# EAGLE design SD A6C GPRS Camera v1.0 (EAGLE 8.1.1)
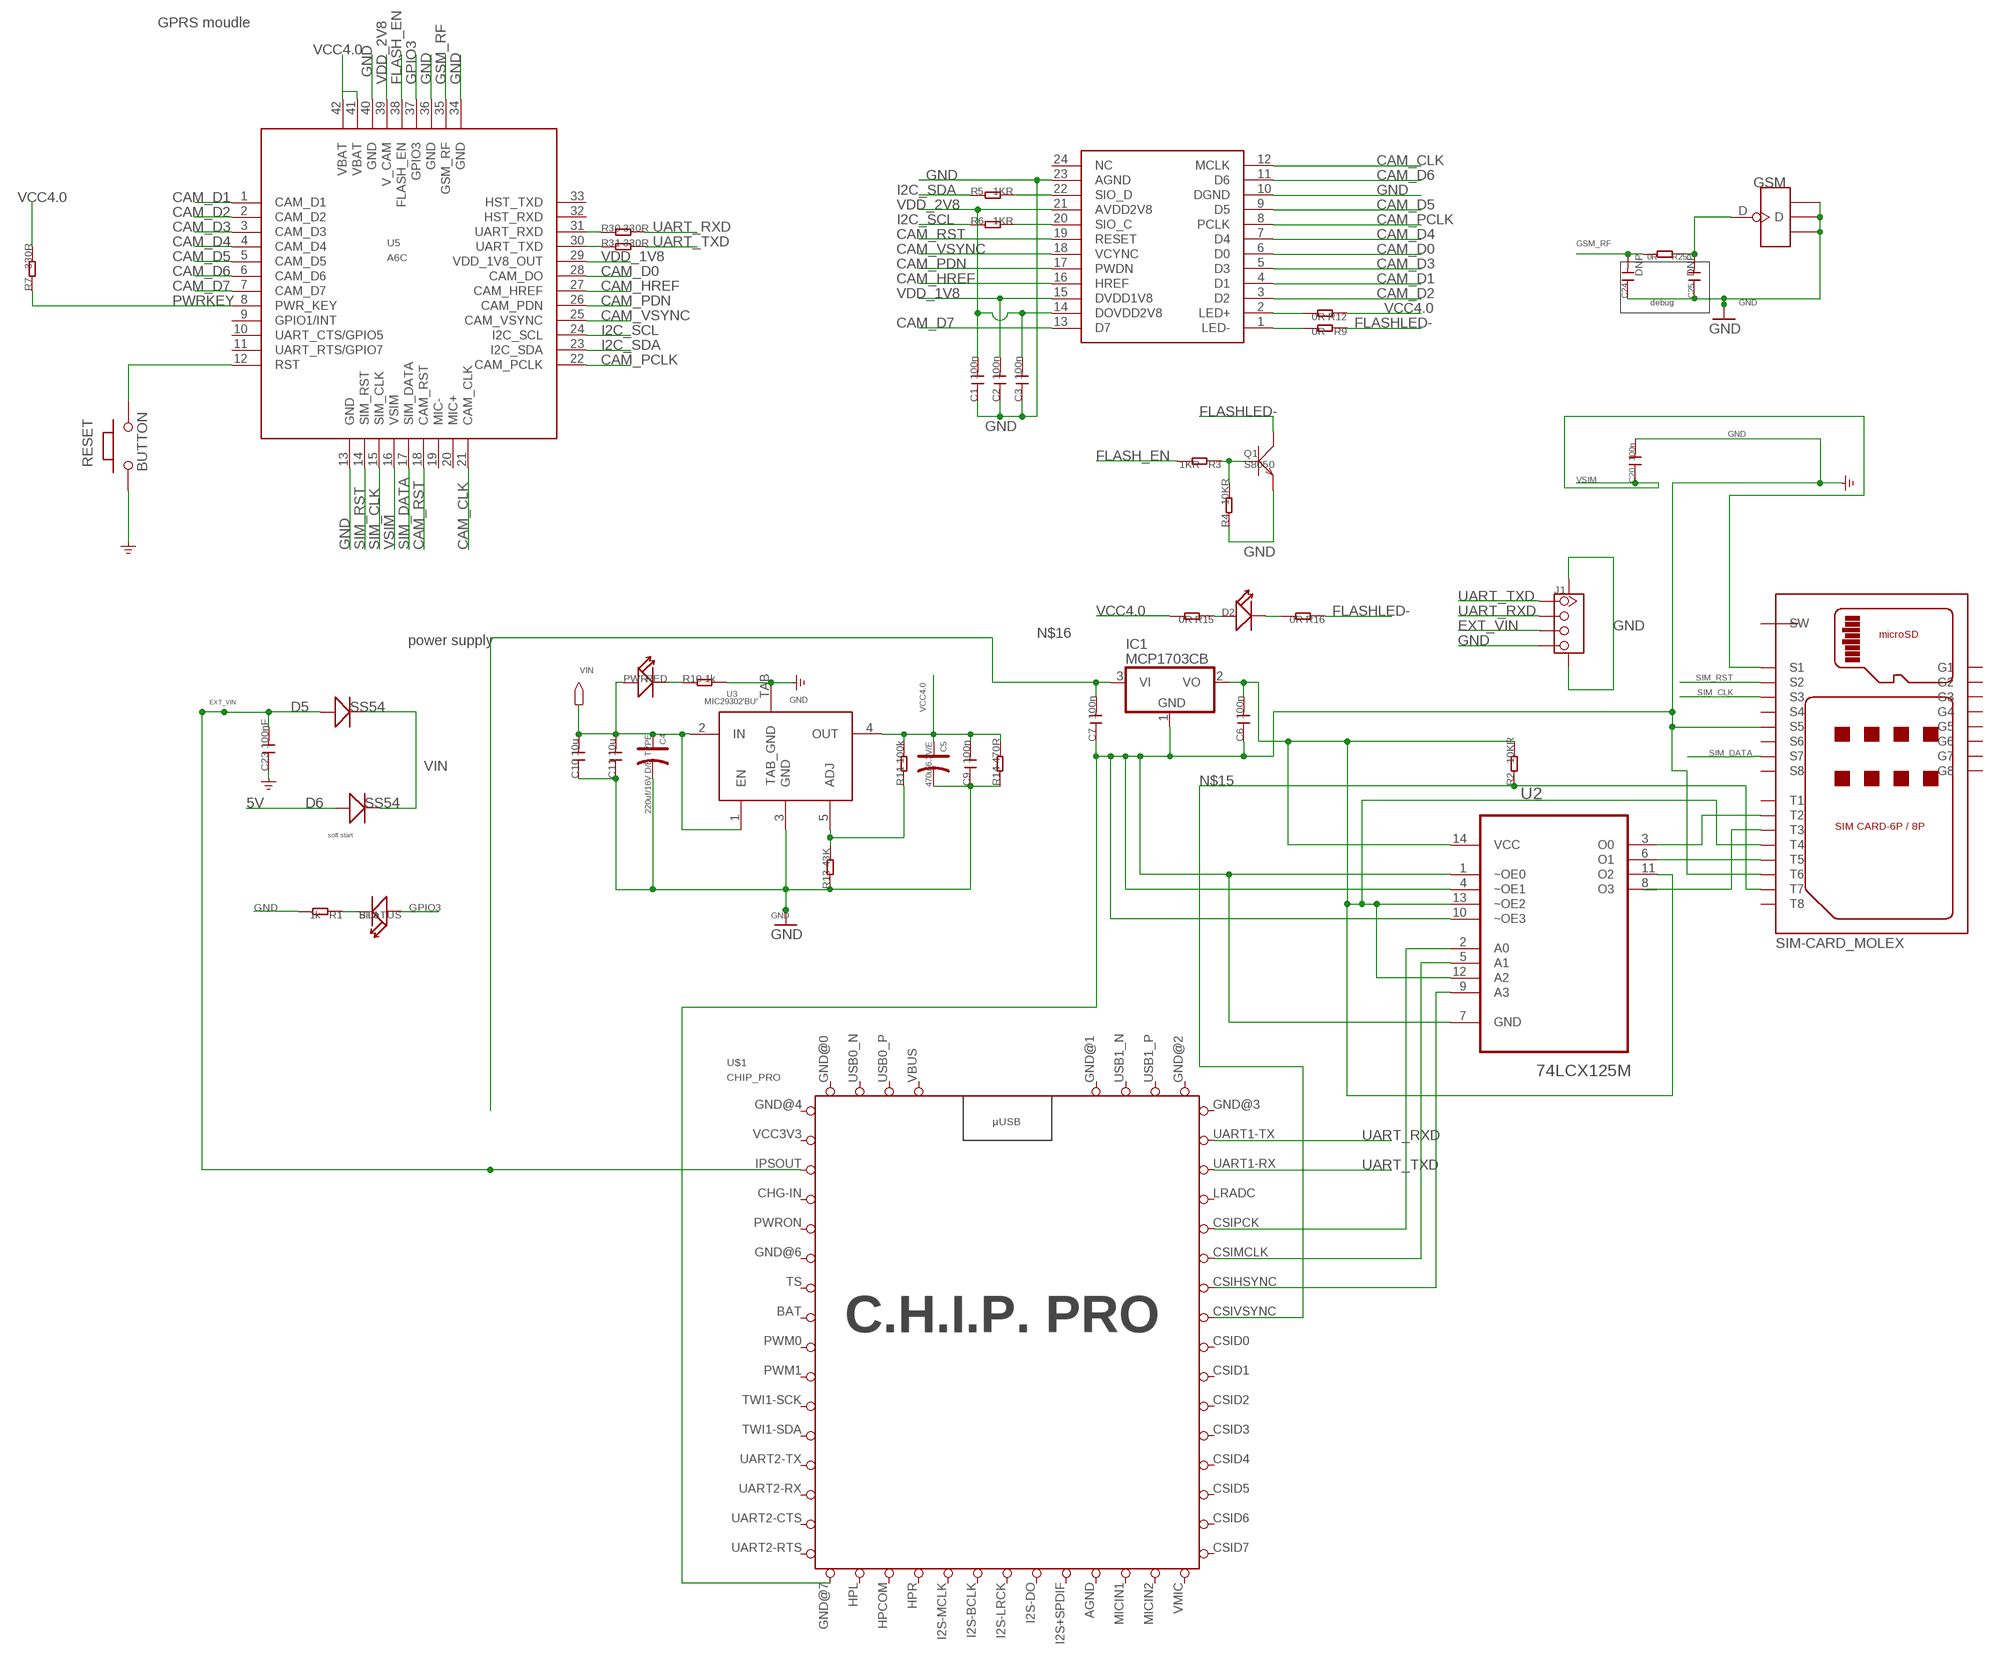
[diagram p0: schematic, sheet 1]

## Parts
C1  100n  C-0603  [C0603]
C2  100n  C-0603  [C0603]
C3  100n  C-0603  [C0603]
C4  220uf/16V D/E TYPE  006-CAP_AVX_D  [AVX_D]
C5  470u/6.3V/E  006-CAP_AVX_D  [AVX_D]
C6  100n  C-0603  [C0603]
C7  100n  C-0603  [C0603]
C9  100n  C-0603  [C0603]
C10  10u  C-0603  [C0603]
C11  10u  C-0603  [C0603]
C20  100n  C-0603  [C0603]
C23  100nF  C-0603  [C0603]
C24  DNP  C-0402  [C0402]
C25  DNP  C-0402  [C0402]
D2  LED'0805'  [LED-0805]
D5  SS54  D'MBRS240LT3'  [SMB]
D6  SS54  D'MBRS240LT3'  [SMB]
GSM  ANTENNA-U-FL  [4P-U-FL]
IC1  MCP1703CB  [SOT23]
J1  TWIG-4P-2.0-SMD-FEMALE-REINFORCE'90D'  [4P-SMD-2.0-90D]
PWR  RED  007-LED0603  [D0603]
Q1  S8050  TRANSISTOR-NPN-SOT23  [SOT23]
R1  1k  R-0603  [R0603]
R2  10KR  R-0603  [R0603]
R3  1KR  R-0603  [R0603]
R4  10KR  R-0603  [R0603]
R5  1KR  R-0603  [R0603]
R6  1KR  R-0603  [R0603]
R7  330R  R-0603  [R0603]
R9  0R  R-0603  [R0603]
R10  1k  R-0603  [R0603]
R11  100k  R-0603  [R0603]
R12  0R  R-0603  [R0603]
R13  43K  R-0603  [R0603]
R14  470R  R-0603  [R0603]
R15  0R  R-0603  [R0603]
R16  0R  R-0603  [R0603]
R25  0R  R-0402  [R0402]
R30  330R  R-0603  [R0603]
R31  330R  R-0603  [R0603]
RESET  BUTTON  PB157  [157SW]
STATUS  Blue  007-LED0603  [D0603]
U1  FPC-SOCKET-0.5-24P  [24P-0.5-90D]
U2  74LCX125M  [SOIC127P600X175-14N]
U3  MIC29302'BU'  [TO-263]
U5  A6C  [A6C]
U$1  CHIP_PRO  [CHIP_PRO]
U$4  SIM-CARD_MOLEX  [SIM-CARD_MOLEX]

## Nets
5V: D6.+
CAM_CLK: U1.12(MCLK) U5.21(CAM_CLK)
CAM_D0: U1.6(D0) U5.28(CAM_DO)
CAM_D1: U1.4(D1) U5.1(CAM_D1)
CAM_D2: U1.3(D2) U5.2(CAM_D2)
CAM_D3: U1.5(D3) U5.3(CAM_D3)
CAM_D4: U1.7(D4) U5.4(CAM_D4)
CAM_D5: U1.9(D5) U5.5(CAM_D5)
CAM_D6: U1.11(D6) U5.6(CAM_D6)
CAM_D7: U1.13(D7) U5.7(CAM_D7)
CAM_HREF: U1.16(HREF) U5.27(CAM_HREF)
CAM_PCLK: U1.8(PCLK) U5.22(CAM_PCLK)
CAM_PDN: U1.17(PWDN) U5.26(CAM_PDN)
CAM_RST: U1.19(RESET) U5.18(CAM_RST)
CAM_VSYNC: U1.18(VCYNC) U5.25(CAM_VSYNC)
EXT_VIN: C23.2 D5.+ J1.3 U$1.IPSOUT
FLASH_EN: R3.2 U5.38(FLASH_EN)
FLASHLED-: Q1.3(C) R9.1 R16.1
GND: C1.1 C2.1 C3.1 C4.- C5.- C6.1 C7.1 C9.1 C10.1 C11.1 C20.2 C23.1 C24.1 C25.1 GSM.GND1 GSM.GND2 GSM.GND3 IC1.1(GND) J1.4 J1.SS1 J1.SS2 Q1.2(E) R1.2 R4.1 R10.2 R13.1 R14.1 RESET.1 U1.10(DGND) U1.23(AGND) U2.1(~OE0) U2.4(~OE1) U2.7(GND) U2.10(~OE3) U3.3(GND) U3.TAB(TAB_GND) U5.13(GND) U5.34(GND) U5.36(GND) U5.40(GND) U$1.GND@7(GND) U$4.S5 U$4.T6
GPIO3: STATUS.+ U5.37(GPIO3)
GSM_RF: C24.2 R25.2 U5.35(GSM_RF)
I2C_SCL: R6.1 U5.24(I2C_SCL)
I2C_SDA: R5.1 U5.23(I2C_SDA)
N$1: R1.1 STATUS.-
N$2: R30.1 U5.31(UART_RXD)
N$3: Q1.1(B) R3.1 R4.2
N$4: R31.1 U5.30(UART_TXD)
N$5: R11.1 R13.2 U3.5(ADJ)
N$6: D2.+ R15.1
N$7: RESET.2 U5.12(RST)
N$8: R5.2 U1.22(SIO_D)
N$9: D2.- R16.2
N$10: R6.2 U1.20(SIO_C)
N$11: U2.6(O1) U$4.T5
N$12: U2.8(O3) U$4.T3
N$13: U2.3(O0) U$4.T2
N$14: C6.2 IC1.2(VO) R2.2 U2.11(O2) U2.12(A2) U2.13(~OE2) U2.14(VCC) U$4.T4
N$15: R2.1 U$1.CSIVSYNC U$4.T7
N$16: C7.2 IC1.3(VI)
N$17: U2.2(A0) U$1.CSIPCK
N$18: U2.5(A1) U$1.CSIMCLK
N$19: PWR.- R10.1
N$20: R9.2 U1.1(LED-)
N$21: R12.2 U1.2(LED+)
N$22: U2.9(A3) U$1.CSIHSYNC
N$25: C25.2 GSM.D R25.1
PWRKEY: R7.1 U5.8(PWR_KEY)
SIM_CLK: U5.15(SIM_CLK) U$4.S3
SIM_DATA: U5.17(SIM_DATA) U$4.S7
SIM_RST: U5.14(SIM_RST) U$4.S2
UART_RXD: J1.2 R30.2 U$1.UART1-TX
UART_TXD: J1.1 R31.2 U$1.UART1-RX
VCC4.0: C5.+ C9.2 R7.2 R11.2 R12.1 R14.2 R15.2 U3.4(OUT) U5.41(VBAT) U5.42(VBAT)
VDD_1V8: C2.2 U1.15(DVDD1V8) U5.29(VDD_1V8_OUT)
VDD_2V8: C1.2 C3.2 U1.14(DOVDD2V8) U1.21(AVDD2V8) U5.39(V_CAM)
VIN: C4.+ C10.2 C11.2 D5.- D6.- PWR.+ U3.1(EN) U3.2(IN)
VSIM: C20.1 U5.16(VSIM) U$4.S1
Unconnected: U1.24(NC) U5.9(GPIO1/INT) U5.10(UART_CTS/GPIO5) U5.11(UART_RTS/GPIO7) U5.19(MIC-) U5.20(MIC+) U5.32(HST_RXD) U5.33(HST_TXD) U$1.BAT U$1.CSID0 U$1.CSID1 U$1.CSID2 U$1.CSID3 U$1.CSID4 U$1.CSID5 U$1.CSID6 U$1.CSID7 U$1.HPCOM U$1.HPL U$1.HPR U$1.I2S+SPDIF(I2SSPDIF) U$1.I2S-BCLK(I2SBCLK) U$1.I2S-DO(I2SDO) U$1.I2S-LRCK(I2SLRCK) U$1.I2S-MCLK(I2SMCLK) U$1.LRADC U$1.MICIN1 U$1.MICIN2 U$1.PWM0 U$1.PWM1 U$1.PWRON U$1.TS U$1.TWI1-SCK U$1.TWI1-SDA U$1.UART2-CTS U$1.UART2-RTS U$1.UART2-RX U$1.UART2-TX U$1.USB0_N U$1.USB0_P U$1.USB1_N U$1.USB1_P U$1.VMIC U$4.G1 U$4.G2 U$4.G3 U$4.G4 U$4.G5 U$4.G6 U$4.G7 U$4.G8 U$4.S4 U$4.S6 U$4.S8 U$4.SW U$4.T1 U$4.T8

## Notes on the sheet
- GPRS moudle
- debug
- power supply
- soft start

## Power pins joined to a net without a drawn wire
AGND: U$1.AGND
CHG-IN: U$1.CHG-IN
GND: U$1.GND@0(GND) U$1.GND@1(GND) U$1.GND@2(GND) U$1.GND@3(GND) U$1.GND@4(GND) U$1.GND@6(GND)
VBUS: U$1.VBUS
VCC3V3: U$1.VCC3V3

## Library data of the parts
C1-C3 C6 C7 C9-C11 C20 C23-C25 = Discrete:C*: Ceramic Capacitors
C4 C5 = Discrete:006-CAP*: Electrolytic Capacitors,Tantalum Capacitors and Super Capacitors
D2 = Discrete:LED*
D5 D6 = Discrete:D*
GSM = Connector:ANTENNA-U-FL
IC1 = linear:MCP1703: 250 mA, 16V, Low Quiescent Current LDO Regulator Source: http://ww1.microchip.com/downloads/en/DeviceDoc/22049b.pdf
J1 = Connector:TWIG-4P-2.0-SMD-FEMALE-REINFORCE
PWR STATUS = Discrete:007-LED*
Q1 = Discrete:TRANSISTOR-NPN*: NPN audion
R1-R7 R9-R16 R25 R30 R31 = Discrete:R*
RESET = MySMD:PB157
U1 = Connector:FPC-SOCKET-0.5-24P
U2 = 74LCX125M:74LCX125M: Low Voltage Quad Buffer with 5V Tolerant Inputs and Outputs; MPN: 74LCX125M; OC_FARNELL: 1013776; OC_NEWARK: 78K6286; PACKAGE: SOIC-14; SUPPLIER: Fairchild
U3 = ICs_v54:MIC29302
U5 = IC:A6C
U$1 = CHIP_Pro-Footprint:CHIP_PRO
U$4 = Molex2:SIM-CARD_MOLEX

## Net classes
1 power: width 0.61 mm, drill 0.61 mm, clearance 0.203 mm
2 gnd: width 0.305 mm, drill 0.559 mm, clearance 0.203 mm
3 usbvcc: width 0.508 mm, drill 0.61 mm, clearance 0.203 mm
4 aref: width 0.254 mm, drill 0.61 mm, clearance 0.254 mm

## Board
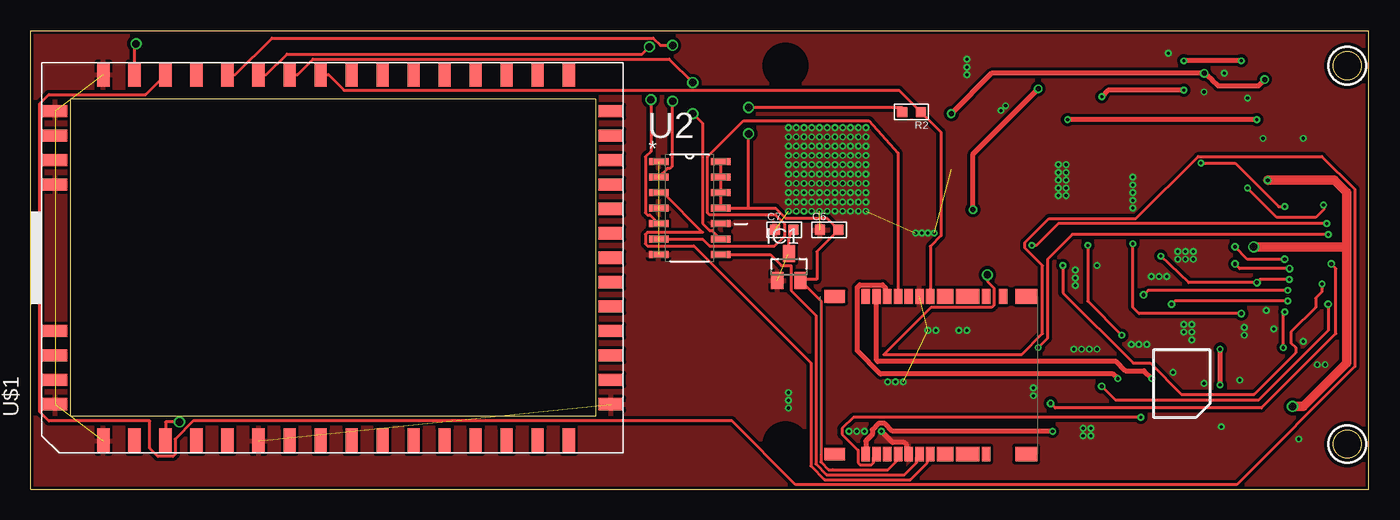
[diagram p1: board, top side]
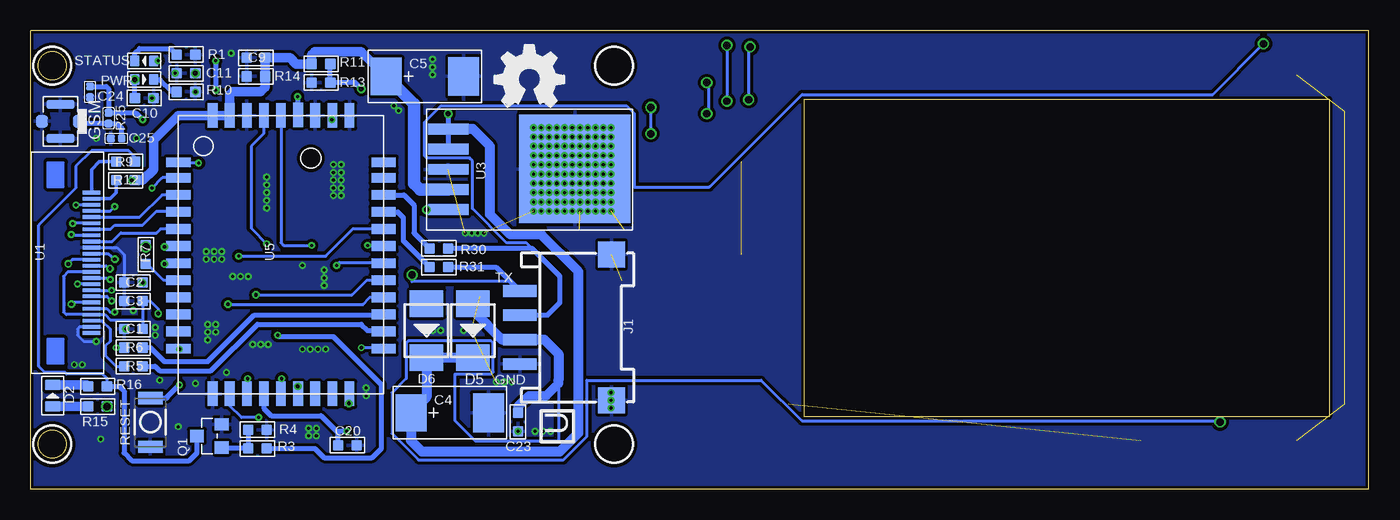
[diagram p2: board, bottom side, seen from below]

Size 109.6 x 37.59 mm. Coordinates in mm from the lower left corner, seen from the top.
Outline: 0,0 0,37.59 109.6,37.59 109.6,0 0,0
Outline: circle at 107.82,34.7 radius 1.14
Outline: circle at 107.82,3.7 radius 1.14
Copper layers (1*16): Top 0.035mm / dielectric 1.5mm / Bottom 0.035mm
Design rules "default": minimum track width 6mil, minimum drill 10mil, track to track 6mil, track to pad 6mil, pad to pad 6mil, via to via 6mil, smd to smd 0mil, copper to edge 10mil, drill to drill 10mil, minimum pad ring 10mil, minimum via ring 6mil, stop-mask expansion 2mil, vias tented up to drill 100mil, thermal gap 10mil
tRestrict: area 60.3,2.2 to 63.3,5.2; area 60.3,33.2 to 63.3,36.2; area 106.3,33.2 to 109.3,36.2; area 106.3,2.2 to 109.3,5.2
bRestrict: area 74.1,43.6 to 74.3,45; area 60.3,2.2 to 63.3,5.2; area 60.3,33.2 to 63.3,36.2; area 106.3,33.2 to 109.3,36.2; area 106.3,2.2 to 109.3,5.2

### Footprints (pad centres in the part's own frame; a part is rotated, then mirrored left to right if it is on the bottom)
C0603 = smd 0.889 x 0.889: 1 -0.762,0; 2 0.762,0
AVX_D = smd 2.54 x 3.048: + -3.175,0 | smd 2.54 x 3.175: - 3.175,0
C0402 = smd 0.635 x 0.635: 1 -0.445,0; 2 0.445,0
LED-0805 = smd 0.889 x 1.27: + -0.889,0; - 0.889,0
SMB = smd 2.159 x 2.743: + -2.21,0; - 2.21,0
4P-U-FL = smd 1.016 x 1.016: D -1.524,0; GND3 1.524,0 | smd 2.286 x 0.762: GND1 0,1.397; GND2 0,-1.397
SOT23 = smd 1 x 1.4: 1 -0.95,-1.1; 2 0.95,-1.1; 3 0,1.1
4P-SMD-2.0-90D = smd 0.965 x 2.74: 1 -3,-0.1; 2 -1,-0.1; 3 1,-0.1; 4 3,-0.1 | smd 2.159 x 2.184: SS1 -5.974,7.4; SS2 5.974,7.4
D0603 = smd 0.762 x 0.889: + -0.762,0; - 0.762,0
SOT23' = smd 1.016 x 1.143: 1 -0.95,-1.016; 2 0.95,-1.016; 3 0,1.016
R0603 = smd 0.889 x 0.889: 1 -0.762,0; 2 0.762,0
R0402 = smd 0.635 x 0.635: 1 -0.445,0; 2 0.445,0
157SW = smd 1.016 x 1.981: 1 0,0; 2 4,0
24P-0.5-90D = smd 0.3 x 1.4: 1 5.08,-1.27; 2 4.58,-1.27; 3 4.08,-1.27; 4 3.58,-1.27; 5 3.08,-1.27; 6 2.58,-1.27; 7 2.08,-1.27; 8 1.58,-1.27; 9 1.08,-1.27; 10 0.58,-1.27; 11 0.08,-1.27; 12 -0.42,-1.27; 13 -0.92,-1.27; 14 -1.42,-1.27; 15 -1.92,-1.27; 16 -2.42,-1.27; 17 -2.92,-1.27; 18 -3.42,-1.27; 19 -3.92,-1.27; 20 -4.42,-1.27; 21 -4.92,-1.27; 22 -5.42,-1.27; 23 -5.92,-1.27; 24 -6.42,-1.27
SOIC127P600X175-14N = smd 1.6 x 0.559: 1 -2.54,3.81; 2 -2.54,2.54; 3 -2.54,1.27; 4 -2.54,0; 5 -2.54,-1.27; 6 -2.54,-2.54; 7 -2.54,-3.81; 8 2.54,-3.81; 9 2.54,-2.54; 10 2.54,-1.27; 11 2.54,0; 12 2.54,1.27; 13 2.54,2.54; 14 2.54,3.81
TO-263 = smd 3.302 x 0.889: 1 3.302,-3.302; 2 3.302,-1.651; 3 3.302,0; 4 3.302,1.651; 5 3.302,3.302 | smd 9.12 x 8.89: TAB -7.071,-0.03
A6C = smd 0.8 x 2: 1 7.57,8.4; 2 6.3,8.4; 3 4.9,8.4; 4 3.5,8.4; 5 2.1,8.4; 6 0.7,8.4; 7 -0.7,8.4; 8 -2.1,8.4; 9 -3.5,8.4; 10 -4.9,8.4; 11 -6.3,8.4; 12 -7.7,8.4; 22 -7.7,-8.4; 23 -6.3,-8.4; 24 -4.9,-8.4; 25 -3.5,-8.4; 26 -2.1,-8.4; 27 -0.7,-8.4; 28 0.7,-8.4; 29 2.1,-8.4; 30 3.5,-8.4; 31 4.9,-8.4; 32 6.3,-8.4; 33 7.57,-8.4 | smd 2 x 0.8: 13 -11.4,5.6; 14 -11.4,4.2; 15 -11.4,2.8; 16 -11.4,1.4; 17 -11.4,0; 18 -11.4,-1.4; 19 -11.4,-2.8; 20 -11.4,-4.2; 21 -11.4,-5.6; 34 11.4,-5.6; 35 11.4,-4.2; 36 11.4,-2.8; 37 11.46,-1.4; 38 11.4,0; 39 11.4,1.4; 40 11.4,2.8; 41 11.4,4.2; 42 11.4,5.6
CHIP_PRO = smd 1 x 2: AGND 6,-22.5; GND@1 -12,-22.5; GND@4 -12,23; GND@6 6,23; GND@7 12,23; HPCOM -8,-22.5; HPL -10,-22.5; HPR -6,-22.5; I2S+SPDIF 4,-22.5; I2S-BCLK -2,-22.5; I2S-DO 2,-22.5; I2S-LRCK 0,-22.5; I2S-MCLK -4,-22.5; MICIN1 8,-22.5; MICIN2 10,-22.5; USB0_N -10,23; USB0_P -8,23; USB1_N 8,23; USB1_P 10,23; VBUS -6,23; VMIC 12,-22.5 | smd 2 x 1: BAT -15,1.27; CHG-IN -15,11.43; CSID0 15,-1.27; CSID1 15,-3.81; CSID2 15,-6.35; CSID3 15,-8.89; CSID4 15,-11.43; CSID5 15,-13.97; CSID6 15,-16.51; CSID7 15,-19.05; CSIHSYNC 15,3.81; CSIMCLK 15,6.35; CSIPCK 15,8.89; CSIVSYNC 15,1.27; GND@0 15,19.05; GND@2 -15,6.35; GND@3 -15,19.05; IPSOUT -15,13.97; LRADC 15,11.43; PWM0 -15,-1.27; PWM1 -15,-3.81; PWRON -15,8.89; TS -15,3.81; TWI1-SCK -15,-6.35; TWI1-SDA -15,-8.89; UART1-RX 15,13.97; UART1-TX 15,16.51; UART2-CTS -15,-16.51; UART2-RTS -15,-19.05; UART2-RX -15,-13.97; UART2-TX -15,-11.43; VCC3V3 -15,16.51
SIM-CARD_MOLEX = smd 1.05 x 1.7: G1 0,1.2; G8 12.91,1.2 | smd 1.2 x 1.34: G2 0,10.25; G7 12.91,10.25 | smd 1.2 x 1.94: G3 0,12.09; G6 12.91,12.09 | smd 1.2 x 1.8: G4 0,16.9; G5 12.91,16.9 | smd 1.2 x 0.7: S1 12.91,3.76; S2 12.91,4.64; S3 0,4.64; S4 0,3.76; S5 12.91,7.28; S6 12.91,5.52; S7 0,5.52; S8 0,7.28; SW 0,15.015; T1 12.91,13.6; T2 12.91,9.04; T3 12.91,8.16; T4 12.91,6.4; T5 0,6.4; T6 0,8.16; T7 0,9.04; T8 0,13.6

### Placement (x,y rotation side)
C1  101.18,13.13 0 bottom
C2  101.18,16.94 0 bottom
C3  101.18,15.42 0 bottom
C4  75.27,6.28 0 bottom
C5  77.3,33.83 0 bottom
C6  65.41,21.26 0 top
C7  61.72,21.26 0 top
C9  91.15,35.36 0 bottom
C10  100.29,32.06 180 bottom
C11  96.86,34.09 0 bottom
C20  83.66,3.61 0 bottom
C23  69.68,5.51 90 bottom
C24  104.74,32.56 90 bottom
C25  102.58,28.75 0 bottom
D2  107.78,7.67 90 bottom
D5  73.37,13.01 270 bottom
D6  77.18,13.01 270 bottom
GSM  107.15,30.15 180 bottom
IC1  62.1,18.21 0 top
J1  69.43,13.26 270 bottom
LOGO2  LOGO-OSHW-FILLX0200-NT  [OSHW_FILLX200_NOTEXT]  71.6,31.33 0 bottom
PWR  100.29,33.58 0 bottom
Q1  S8050  [SOT23']  94.96,4.37 90 bottom
R1  96.86,35.61 0 bottom
R2  72.14,30.91 180 top
R3  91.02,3.35 0 bottom
R4  91.02,4.88 180 bottom
R5  101.18,10.08 180 bottom
R6  101.18,11.61 180 bottom
R7  100.16,19.23 90 bottom
R9  101.82,26.85 180 bottom
R10  96.86,32.56 0 bottom
R11  85.81,34.85 180 bottom
R12  101.82,25.32 180 bottom
R13  85.81,33.33 0 bottom
R14  91.15,33.83 0 bottom
R15  104.1,6.78 0 bottom
R16  104.1,8.43 180 bottom
R25  103.21,30.41 90 bottom
R30  76.16,19.74 0 bottom
R31  76.16,18.21 0 bottom
RESET  99.78,3.48 90 bottom
STATUS  100.29,35.1 180 bottom
U1  105.88,19.23 90 bottom
U2  53.98,23.04 0 top
U3  72.1,26.21 180 bottom
U5  89.09,19.23 90 bottom
U$1  25.02,18.97 90 top
U$4  64.64,15.8 270 top

### Tracks (layer width: path | path; a pad name or v marks a point on that pad's centre or on a via)
CAM_CLK  (via drill 0.3)
  Top 0.254: v83.53,7.04 83.91,6.66 100.8,6.66 106.9,12.75 106.9,18.09 v106.52,18.47
  Bottom 0.254: U1.12 106.17,18.81 v106.52,18.47 | v83.53,7.04 83.53,7.79 U5.21
CAM_D0  (via drill 0.25)
  Top 0.254: v106.13,21.77 84.16,21.77 82.38,19.99 v82,19.99
  Bottom 0.254: U1.6 106.09,21.81 v106.13,21.77 | v82,19.99 80.75,19.99 U5.28
CAM_D1  (via drill 0.25)
  Top 0.254: v95.85,26.72 98.64,26.72 102.2,23.17 v102.7,23.17
  Bottom 0.254: U1.4 103.06,22.81 v102.7,23.17 | v95.85,26.72 97.41,26.72 U5.1
CAM_D2  (via drill 0.25)
  Top 0.254: v105.88,23.29 105.88,22.91 105.24,22.28 102.07,22.28 v99.66,24.69
  Bottom 0.254: U1.3 105.86,23.31 v105.88,23.29 | v99.66,24.69 98.82,25.53 U5.2
CAM_D3
  Bottom 0.254: U1.5 100.64,22.31 98.82,24.13 U5.3
CAM_D4
  Bottom 0.254: U5.4 97.55,22.79 99.28,22.79 100.42,21.64 102.7,21.64 103.04,21.31 U1.7
CAM_D5
  Bottom 0.254: U1.9 102.89,20.31 102.2,21.01 99.28,21.01 98.95,21.33 U5.5
CAM_D6  (via drill 0.3)
  Top 0.254: v102.7,18.85 99.66,18.85 v98.64,19.86
  Bottom 0.254: U1.11 103.29,19.31 v102.7,18.85 | v98.64,19.86 97.56,19.86 U5.6
CAM_D7  (via drill 0.3)
  Top 0.254: v103.09,18.09 99.02,18.09 v98.64,18.47
  Bottom 0.254: U1.13 103.44,18.31 v103.09,18.09 | v98.64,18.47 97.55,18.47 U5.7
CAM_HREF  (via drill 0.25)
  Top 0.254: v105.75,16.82 105.75,16.18 105.24,15.67 105.24,14.91 103.21,12.88 103.21,11.99 103.59,11.61 103.59,11.19 100.2,7.8 94.23,7.8 91.69,10.34 90.3,10.34 84.54,16.09 v84.54,18.34
  Bottom 0.254: U1.16 v105.75,16.81 v105.75,16.82 | v84.54,18.34 84.29,18.59 80.76,18.59 U5.27
CAM_PCLK  (via drill 0.25)
  Top 0.254: v106.26,20.88 85.31,20.88 83.27,18.85 83.27,12.37 v82.51,11.61
  Bottom 0.254: U1.8 106.19,20.81 v106.26,20.88 | v82.51,11.61 80.77,11.61 U5.22
CAM_PDN  (via drill 0.25, 0.3)
  Top 0.254: v102.96,16.31 91.53,16.31 v91.15,15.93
  Bottom 0.254: U1.17 103.59,16.31 v102.96,16.31 | v91.15,15.93 83.27,15.93 82.07,17.13 U5.26
CAM_RST  (via drill 0.3)
  Top 0.254: v106.26,15.16 106.26,13.01 100.55,7.29 88.86,7.29 v87.72,8.43
  Bottom 0.254: U1.19 106.12,15.31 v106.26,15.16 | v87.72,8.43 87.72,7.86 U5.18
CAM_VSYNC  (via drill 0.25, 0.3)
  Top 0.254: v102.96,15.42 93.69,15.42 v93.43,15.16
  Bottom 0.254: U1.18 103.35,15.81 v102.96,15.42 | v93.43,15.16 82.38,15.16 81.82,15.73 U5.25
EXT_VIN  (via drill 0.6)
  Top 0.254: v12.19,5.51 11.05,5.51 U$1.IPSOUT
  Bottom 0.254: v12.19,5.51 12.27,5.59 46.43,5.59 49.78,8.94 64.05,8.94 64.05,4.34 65.97,2.41 77.84,2.41 80,4.57 80,7.92 78.83,9.08 78.83,11.99 78.66,12.15 71.88,12.15 71.72,11.99 71.72,9.6 71.88,9.44 74.85,9.44 74.85,5.62 73.17,3.94 66.38,3.94 66.38,8.94
  Bottom 0.762: C23.2 69.68,6.78 68.8,7.67 67.4,7.67 66.38,8.69 66.38,8.94
  Bottom 0.813: 66.38,8.94 66.38,11.1 67.53,12.24 69.52,12.24 J1.3 70.97,12.26 73.37,14.66 D5.+
FLASH_EN  (via drill 0.25)
  Top 0.254: v86.58,19.99 86.58,15.42 v89.37,12.62
  Bottom 0.254: U5.38 89.09,20.22 88.86,19.99 v86.58,19.99
  Bottom 0.406: R3.2 86.32,3.35 85.56,2.59 81.62,2.59 80.86,3.35 80.86,8.56 84.8,12.5 89.24,12.5 v89.37,12.62
FLASHLED-
  Bottom 0.254: R9.1 101.05,27.23 101.56,27.74 104.61,27.74 105.88,26.47 105.88,24.69 108.93,21.64 108.93,10.08 108.42,9.58 106.77,9.58 106.64,9.45 103.72,9.45 103.34,9.07 R16.1
  Bottom 0.406: R16.1 102.32,8.43 101.94,8.05 101.94,2.97 101.31,2.34 96.61,2.34 95.97,2.97 Q1.3
GND  (via drill 0.25)  (14 unrouted)
  Top 0.406: U$4.S5 71.75,3.06 71.75,3.64 71.54,3.85 70.59,3.85 C23.1
  Bottom 0.254: U1.10 102.52,19.81 101.94,19.23 C2.1 | U1.23 105.58,13.31 105.75,13.13 105.75,12.62 105.24,12.12 v104.23,12.12
  other vias: 99.02,8.94 101.82,13.13 105.37,10.21 103.85,4.12 97.5,5.13 101.18,14.66 99.4,12.62 96.1,32.56 97.75,34.09 93.18,35.74 76.67,34.6 72.99,21.01 79.84,31.42 79.46,31.04 73.49,21.01 74,21.01 72.48,21.01 76.67,33.96 76.67,35.23 99.66,32.06 100.93,28.75 104.23,28.75 69.68,4.75 67.02,4.75 62.07,7.93 62.07,7.29 62.07,6.66 96.1,8.69 95.08,12.88 91.4,11.86 86.83,5 86.83,4.37 86.19,5 86.19,4.37 94.45,12.88 95.08,12.24 95.08,13.51 94.45,13.51 90.77,11.86 90.13,11.86 93.56,9.58 91.78,17.45 95.21,19.48 86.07,11.48 76.67,13.01 82.13,8.31 87.34,18.34 85.56,17.32 90.26,23.04 90.26,23.67 90.26,24.31 86.7,11.48 87.34,11.48 85.43,11.48 85.56,17.96 85.56,16.69 94.58,19.48 93.94,19.48 93.94,18.85 94.58,18.85 95.21,18.85 92.42,17.45 93.05,17.45 99.4,13.26 106.01,10.21 82.13,7.67 76.03,13.01 74.13,13.01 73.49,13.01 84.8,26.59 84.16,26.59 84.8,25.96 84.8,25.32 84.8,24.69 84.8,24.05 84.16,25.96 84.16,25.32 84.16,24.69 84.16,24.05 90.26,24.94 90.26,25.58 68.41,29.64 67.78,29.64 67.14,29.64 66.51,29.64 65.88,29.64 65.24,29.64 64.6,29.64 63.97,29.64 63.34,29.64 62.7,29.64 62.07,29.64 68.41,28.12 67.78,28.12 67.14,28.12 66.51,28.12 65.88,28.12 65.24,28.12 64.6,28.12 63.97,28.12 63.34,28.12 62.7,28.12 62.07,28.12 68.41,28.88 67.78,28.88 67.14,28.88 66.51,28.88 65.88,28.88 65.24,28.88 64.6,28.88 63.97,28.88 63.34,28.88 62.7,28.88 62.07,28.88 68.41,27.36 67.78,27.36 67.14,27.36 66.51,27.36 65.88,27.36 65.24,27.36 64.6,27.36 63.97,27.36 63.34,27.36 62.7,27.36 62.07,27.36 68.41,26.59 67.78,26.59 67.14,26.59 66.51,26.59 65.88,26.59 65.24,26.59 64.6,26.59 63.97,26.59 63.34,26.59 62.7,26.59 62.07,26.59 68.41,25.83 67.78,25.83 67.14,25.83 66.51,25.83 65.88,25.83 65.24,25.83 64.6,25.83 63.97,25.83 63.34,25.83 62.7,25.83 62.07,25.83 68.41,25.07 67.78,25.07 67.14,25.07 66.51,25.07 65.88,25.07 65.24,25.07 64.6,25.07 63.97,25.07 63.34,25.07 62.7,25.07 62.07,25.07 68.41,24.31 67.78,24.31 67.14,24.31 66.51,24.31 65.88,24.31 65.24,24.31 64.6,24.31 63.97,24.31 63.34,24.31 62.7,24.31 62.07,24.31 68.41,23.55 67.78,23.55 67.14,23.55 66.51,23.55 65.88,23.55 65.24,23.55 64.6,23.55 63.97,23.55 63.34,23.55 62.7,23.55 62.07,23.55 68.41,22.79 67.78,22.79 67.14,22.79 66.51,22.79 65.88,22.79 65.24,22.79 64.6,22.79 63.97,22.79 63.34,22.79 62.7,22.79 62.07,22.79 71.46,8.81 70.83,8.81 70.19,8.81 68.29,4.75 67.65,4.75
  pour Top (isolate 0.254): 111.34,-1.09 -2.45,-0.84 -1.05,38.28 112.74,38.02
  pour Bottom (isolate 0.254): 111.59,-1.22 -2.83,-0.96 -1.69,38.28 112.74,38.02
GPIO3  (via drill 0.25)
  Top 0.406: v99.15,35.1 v94.45,35.1 | v94.45,32.69 88.23,32.69 v87.72,32.18
  Bottom 0.406: STATUS.+ v99.15,35.1 | v94.45,35.1 v94.45,32.69 | v87.72,32.18 87.72,30.72 U5.37
GSM_RF  (via drill 0.25)
  Top 0.406: v100.42,30.28 v84.92,30.28
  Bottom 0.406: v100.42,30.28 100.99,30.85 R25.2 103.21,32.82 103.4,33.01 C24.2 | 84.92,30.53 v84.92,30.28 84.89,30.31 U5.35
I2C_SCL
  Bottom 0.406: R6.1 99.78,11.61 98.64,10.47 95.08,10.47 91.27,14.28 80.74,14.28 U5.24
I2C_SDA
  Bottom 0.406: R5.1 99.4,10.08 99.02,9.7 94.83,9.7 91.02,13.51 82.51,13.51 82,13.01 80.77,13.01 U5.23
N$1
  Bottom 0.406: STATUS.- 101.05,35.74 100.67,36.12 98.13,36.12 R1.1
N$2
  Bottom 0.406: U5.31 79.03,24.13 78.19,23.29 78.19,21.01 R30.1
N$3
  Bottom 0.406: Q1.1 93.88,3.35 R3.1 R4.2
N$4
  Bottom 0.406: U5.30 79.53,22.73 79.08,22.28 79.08,20.37 R31.1
N$5  (via drill 0.41)
  Top 0.406: v77.18,22.91 77.18,27.48 v82.51,32.82
  Bottom 0.406: R11.1 R13.2 83.02,33.33 v82.51,32.82 | U3.5 v77.18,22.91
N$6
  Bottom 0.762: R15.1 D2.+
N$7  (via drill 0.25)
  Top 0.406: v97.41,8.56 v97.41,11.48
  Bottom 0.406: RESET.2 98.45,7.48 98.45,7.52 v97.41,8.56 | v97.41,11.48 97.41,11.45 U5.12
N$8
  Bottom 0.254: U1.22 103.76,13.81 103.09,13.13 103.09,12.12 103.47,11.74 103.47,10.97 102.58,10.08 R5.2
N$9
  Bottom 0.762: D2.- 104.99,8.56 R16.2
N$10  (via drill 0.25)
  Top 0.254: v102.58,11.61 102.58,14.4 v102.7,14.53
  Bottom 0.254: U1.20 103.36,14.81 103.09,14.53 v102.7,14.53 | v102.58,11.61 R6.2
N$11
  Top 0.254: U2.6 55.04,20.5 55.6,19.94 60.93,19.94 61.76,20.77 61.76,21.72 61.01,22.48 55.6,22.48 55.44,22.64 55.44,27.24 58.39,30.2 68.65,30.2 71.04,27.55 U$4.T5
N$12
  Top 0.254: U2.8 60.59,19.23 61.49,18.33 62.27,18.33 62.27,16.3 64.31,14.26 64.31,2.08 65.19,1.2 71.58,1.2 72.55,2.17 72.55,2.64 U$4.T3
N$13
  Top 0.254: U$4.T2 73.43,2.64 73.43,2.17 72.05,0.79 65.02,0.79 63.9,1.91 63.9,10.37 54.33,19.94 50.52,19.94 50.36,20.1 50.36,20.89 50.52,21.06 55.03,21.06 51.78,24.31 U2.3
N$14  (via drill 0.6)
  Top 0.254: U2.14 U2.13 U2.12 U2.11 58.8,23.04 | 58.8,23.04 61.02,23.04 61.83,22.23 65.2,22.23 C6.2 64.39,19.48 64.39,17.2 63.05,17.2 IC1.2 64.71,15.45 64.71,2.25 65.36,1.6 65.69,1.6 70.22,1.6 71.04,2.42 U$4.T4 | 58.8,23.04 v58.8,29.13 | v58.8,31.29 71.37,31.29 R2.2
  Bottom 0.254: v58.8,29.13 v58.8,31.29
N$15
  Top 0.254: U$4.T7 73.68,19.9 74.56,20.78 74.56,29.25 R2.1 71.11,32.7 25.67,32.7 24.39,33.98 U$1.CSIVSYNC
N$16
  Top 0.254: IC1.3 62.1,20.53 62.17,20.6 62.17,20.94 C7.2
N$17  (via drill 0.6)
  Top 0.254: U$1.CSIPCK 16.77,33.98 19.78,36.98 50.98,36.98 51.58,36.37 v52.58,36.37 | U2.2 52.15,26.29 52.35,26.29 52.52,26.45 52.52,31.74 v52.58,31.8
  Bottom 0.254: v52.58,36.37 v52.58,31.8
N$18  (via drill 0.6)
  Top 0.254: U$1.CSIMCLK 19.31,33.98 21,35.66 50.09,35.66 v50.67,36.25 | U2.5 50.72,22.48 50.52,22.48 50.36,22.64 50.36,27.24 50.8,27.69 v50.8,31.93
  Bottom 0.254: v50.67,36.25 50.8,36.25 v50.8,31.93
N$19
  Bottom 0.406: PWR.- 99.02,33.58 98.01,32.56 R10.1
N$20
  Bottom 0.305: U1.1 104.61,26.21 103.97,26.85 R9.2
N$21
  Bottom 0.305: U1.2 103.08,23.81 102.58,24.31 R12.2
N$22  (via drill 0.6)
  Top 0.254: U$1.CSIHSYNC 21.85,33.98 23.13,35.25 52.3,35.25 v54.23,33.33 | U2.9 55.8,21.21 55.6,21.21 55.03,21.78 55.03,29.99 v54.23,30.79
  Bottom 0.254: v54.23,33.33 54.1,33.33 54.1,30.79 v54.23,30.79
N$25
  Bottom 0.406: GSM.D 105.43,29.96 R25.1 102.52,29.96 102.13,29.58 C25.2
PWRKEY
  Bottom 0.254: R7.1 100.04,18.47 98.7,17.13 U5.8
SIM_CLK  (via drill 0.25)
  Top 0.406: v91.82,9.07 91.19,9.7 89.66,9.7 88.9,10.47 69.39,10.47 69.28,10.57 U$4.S3
  Bottom 0.406: v91.82,9.07 91.82,7.9 U5.15
SIM_DATA  (via drill 0.25)
  Top 0.406: v89.03,9.07 88.65,9.45 69.62,9.45 67.7,11.37 67.7,16.55 67.91,16.76 69.78,16.76 69.99,16.55 69.99,15.97 U$4.S7
  Bottom 0.406: v89.03,9.07 89.03,7.89 U5.17
SIM_RST  (via drill 0.25)
  Top 0.254: U$4.S2 69.03,2.64 69.03,2.17 68.87,2.01 67.94,2.01 67.77,2.17 67.77,3.2 66.46,4.52 66.46,4.98 67.37,5.89 v90.93,5.89
  Bottom 0.254: v90.93,5.89 92.33,5.89 93.29,6.86 U5.14
UART_RXD  (via drill 0.6)
  Top 0.254: v8.64,36.5 8.51,36.5 U$1.UART1-TX
  Bottom 0.254: v8.64,36.5 12.78,32.36 46.43,32.36 54.01,24.77 60.19,24.77 60.19,30.8 60.8,31.42 75.99,31.42 77.33,30.08 77.33,27.3 77.17,27.14 73.63,27.14 73.41,26.92 73.41,23 70.6,20.19 69,20.19 66.26,17.45
  Bottom 0.406: J1.2 67.29,14.26 66.26,15.29 66.26,17.45 68.54,19.74 R30.2
UART_TXD  (via drill 0.6)
  Top 0.254: U$1.UART1-RX 9.43,32.36 1.5,32.36 0.74,31.59 0.74,6.36 1.5,5.59 9.77,5.59 9.77,3.36 10.43,2.7 11.67,2.7 11.83,2.86 11.83,4.11 13.31,5.59 57.45,5.59 62.66,0.38 98.77,0.38 108.44,10.06 108.44,24.58 105.75,27.28 95.62,27.28 90.51,22.18 83.4,22.18 81.44,20.22 81.44,19.76 82.87,18.34 82.87,12.75 81.16,11.05 69.87,11.05 73.74,14.92 78.71,14.92 78.87,15.08 78.87,16.52 78.36,17.03 v78.36,17.58
  Bottom 0.254: 70.29,17.02 78.36,17.02 v78.36,17.58
  Bottom 0.406: R31.2 71.48,18.21 70.29,17.02 J1.1
VCC4.0  (via drill 0.3, 0.61)
  Top 0.762: v100.16,19.86 107.78,19.86 | R15.2 104.23,6.78 107.78,10.34 107.78,19.86 | v101.31,25.32 106.77,25.32 107.78,24.31 107.78,19.86
  Bottom 0.254: R12.1 v101.31,25.32
  Bottom 0.762: C5.+ 82.51,35.87 86.32,35.87 86.58,35.61 R11.2 87.85,34.85 88.35,35.36 C9.2 R14.2 90.39,32.95 90.77,32.56 93.05,32.56 93.29,32.33 U5.41 U5.42 97.53,30.63 99.53,28.63 99.53,26.21 100.42,25.32 R12.1 | R7.2 v100.16,19.86
  Bottom 1.016: U3.4 77.69,24.56 78.19,25.07 78.19,31.55 C5.+
  other vias: 103.34,6.78
VDD_1V8  (via drill 0.25, 0.3)
  Top 0.254: v92.55,19.1 94.83,16.94 C2.2 100.67,17.2 v103.09,17.2
  Bottom 0.254: U5.29 83.21,21.33 85.43,19.1 v92.55,19.1 | U1.15 103.2,17.31 v103.09,17.2
  other vias: 100.42,16.94
VDD_2V8  (via drill 0.25, 0.3)
  Top 0.254: v99.15,14.4 90.77,14.4 90.26,14.91 v90.26,20.12
  Bottom 0.254: U1.14 106.54,17.81 106.9,17.45 106.9,14.53 106.67,14.31 U1.21 103.5,14.31 103.09,13.89 100.42,13.89 | 100.42,13.89 C3.2 99.78,15.42 99.15,14.78 v99.15,14.4 | 100.42,13.89 C1.2 | U5.39 90.49,29.16 91.53,28.12 91.53,21.39 v90.26,20.12
VIN  (via drill 0.41)
  Top 0.406: v75.4,30.79 78.7,34.09 C11.2 96.74,33.58 97.24,33.07 100.55,33.07 PWR.+
  Bottom 0.406: C10.2 PWR.+ | 95.97,34.09 C11.2 | v75.4,30.79 U3.1 U3.2
  Bottom 0.813: U3.1 73.37,29.52 71.97,28.12 71.97,22.53 70.32,20.88 67.78,20.88 64.73,17.83 64.73,4.62 66.26,3.1 77.56,3.1 78.45,3.99 C4.+ 77.18,7.54 D6.- D5.-
  other vias: 101.05,33.58 96.1,34.09
VSIM  (via drill 0.25)
  Top 0.406: U$4.S1 68.4,3.97 68.92,4.49 68.92,4.89 69.42,5.39 69.95,5.39 70.58,4.75 v83.69,4.75
  Bottom 0.406: U5.16 90.49,6.63 89.88,6.02 85.81,6.02 84.42,4.62 | C20.1 84.42,4.62 | v83.69,4.75 84.29,4.75 84.42,4.62

### Text on the board
bPlace: U
bNames: TX | GND
tValues: Crowtail- A6C GPRS Camera | v0.9 | www.elecrow.com